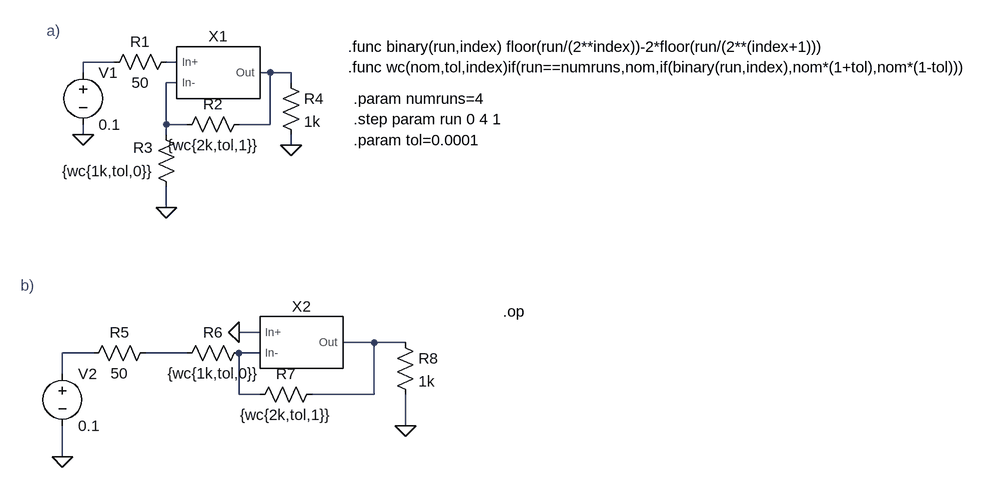
[diagram p0: schematic Lab4In.asc]
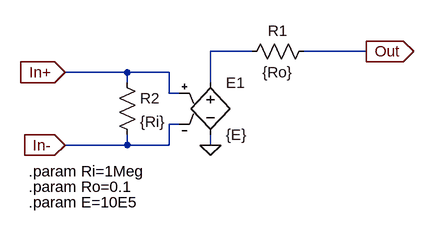
[diagram p1: sub-circuit vcvs_model.asc]
Lab4In.asc, the LTspice schematic file:
Version 4
SHEET 1 1512 724
WIRE 48 96 0 96
WIRE 144 96 128 96
WIRE 0 112 0 96
WIRE 288 112 272 112
WIRE 320 112 288 112
WIRE 144 128 128 128
WIRE 320 128 320 112
WIRE 128 192 128 128
WIRE 160 192 128 192
WIRE 288 192 288 112
WIRE 288 192 240 192
WIRE 0 208 0 192
WIRE 128 208 128 192
WIRE 320 224 320 208
WIRE 128 320 128 288
WIRE 272 512 240 512
WIRE 448 528 400 528
WIRE 496 528 448 528
WIRE 16 544 -32 544
WIRE 160 544 96 544
WIRE 272 544 240 544
WIRE -32 576 -32 544
WIRE 240 608 240 544
WIRE 272 608 240 608
WIRE 448 608 448 528
WIRE 448 608 352 608
WIRE 496 656 496 608
WIRE -32 704 -32 656
FLAG 0 208 0
FLAG 128 320 0
FLAG 320 224 0
FLAG -32 704 0
FLAG 496 656 0
FLAG 240 512 0
SYMBOL voltage 0 96 R0
SYMATTR InstName V1
SYMATTR Value 0.1
SYMBOL res 144 80 R90
WINDOW 0 0 56 VBottom 2
WINDOW 3 32 56 VTop 2
SYMATTR InstName R1
SYMATTR Value 50
SYMBOL VCVS_Model 208 112 R0
SYMATTR InstName X1
SYMBOL res 256 176 R90
WINDOW 0 0 56 VBottom 2
WINDOW 3 32 56 VTop 2
SYMATTR InstName R2
SYMATTR Value {wc{2k,tol,1}}
SYMBOL res 144 304 R180
WINDOW 0 36 76 Left 2
WINDOW 3 36 40 Left 2
SYMATTR InstName R3
SYMATTR Value {wc{1k,tol,0}}
SYMBOL res 304 112 R0
SYMATTR InstName R4
SYMATTR Value 1k
SYMBOL voltage -32 560 R0
SYMATTR InstName V2
SYMATTR Value 0.1
SYMBOL res 112 528 R90
WINDOW 0 0 56 VBottom 2
WINDOW 3 32 56 VTop 2
SYMATTR InstName R5
SYMATTR Value 50
SYMBOL res 256 528 R90
WINDOW 0 0 56 VBottom 2
WINDOW 3 32 56 VTop 2
SYMATTR InstName R6
SYMATTR Value {wc{1k,tol,0}}
SYMBOL VCVS_Model 336 528 R0
SYMATTR InstName X2
SYMBOL res 368 592 R90
WINDOW 0 0 56 VBottom 2
WINDOW 3 32 56 VTop 2
SYMATTR InstName R7
SYMATTR Value {wc{2k,tol,1}}
SYMBOL res 480 512 R0
SYMATTR InstName R8
SYMATTR Value 1k
TEXT -56 48 Left 2 ;a)
TEXT 408 72 Left 2 !.func binary(run,index) floor(run/(2**index))-2*floor(run/(2**(index+1)))
TEXT 408 104 Left 2 !.func wc(nom,tol,index)if(run==numruns,nom,if(binary(run,index),nom*(1+tol),nom*(1-tol)))
TEXT 416 152 Left 2 !.param numruns=4
TEXT 416 184 Left 2 !.step param run 0 4 1
TEXT 416 216 Left 2 !.param tol=0.0001
TEXT -96 440 Left 2 ;b)
TEXT 646 480 Left 2 !.op

vcvs_model.asc, the sub-circuit schematic file:
Version 4
SHEET 1 880 680
WIRE 224 64 160 64
WIRE 400 64 304 64
WIRE 32 96 -64 96
WIRE 96 96 32 96
WIRE 32 112 32 96
WIRE 160 112 160 64
WIRE 96 128 96 96
WIRE 112 128 96 128
WIRE 112 176 96 176
WIRE 32 208 32 192
WIRE 32 208 -64 208
WIRE 96 208 96 176
WIRE 96 208 32 208
WIRE 160 208 160 192
FLAG 160 208 0
FLAG -64 96 In+
IOPIN -64 96 In
FLAG -64 208 In-
IOPIN -64 208 In
FLAG 400 64 Out
IOPIN 400 64 Out
SYMBOL e 160 96 R0
SYMATTR InstName E1
SYMATTR Value {E}
SYMBOL res 320 48 R90
WINDOW 0 0 56 VBottom 2
WINDOW 3 32 56 VTop 2
SYMATTR InstName R1
SYMATTR Value {Ro}
SYMBOL res 16 96 R0
SYMATTR InstName R2
SYMATTR Value {Ri}
TEXT -120 248 Left 2 !.param Ri=1Meg
TEXT -120 272 Left 2 !.param Ro=0.1
TEXT -120 296 Left 2 !.param E=10E5

The netlist it stands for:
* Lab4In.asc
V1 N001 0 0.1
R1 N002 N001 50
XX1 N002 N004 N003 vcvs_model
R2 N003 N004 {wc{2k,tol,1}}
R3 0 N004 {wc{1k,tol,0}}
R4 N003 0 1k
V2 N006 0 0.1
R5 N007 N006 50
R6 N008 N007 {wc{1k,tol,0}}
XX2 0 N008 N005 vcvs_model
R7 N005 N008 {wc{2k,tol,1}}
R8 N005 0 1k

* block symbol definitions
.subckt vcvs_model In+ In- Out
E1 N001 0 In+ In- {E}
R1 Out N001 {Ro}
R2 In+ In- {Ri}
.param Ri=1Meg
.param Ro=0.1
.param E=10E5
.ends vcvs_model

* a)
.func binary(run,index) floor(run/(2**index))-2*floor(run/(2**(index+1)))
.func wc(nom,tol,index)if(run==numruns,nom,if(binary(run,index),nom*(1+tol),nom*(1-tol)))
.param numruns=4
.step param run 0 4 1
.param tol=0.0001
* b)
.op
.backanno
.end